# EAGLE design MultiSensorModul.v4 (EAGLE 9.6.2)
COMPANY: ADAFRUIT INDUSTRIES; DRAWN: KTOWN; REV: A
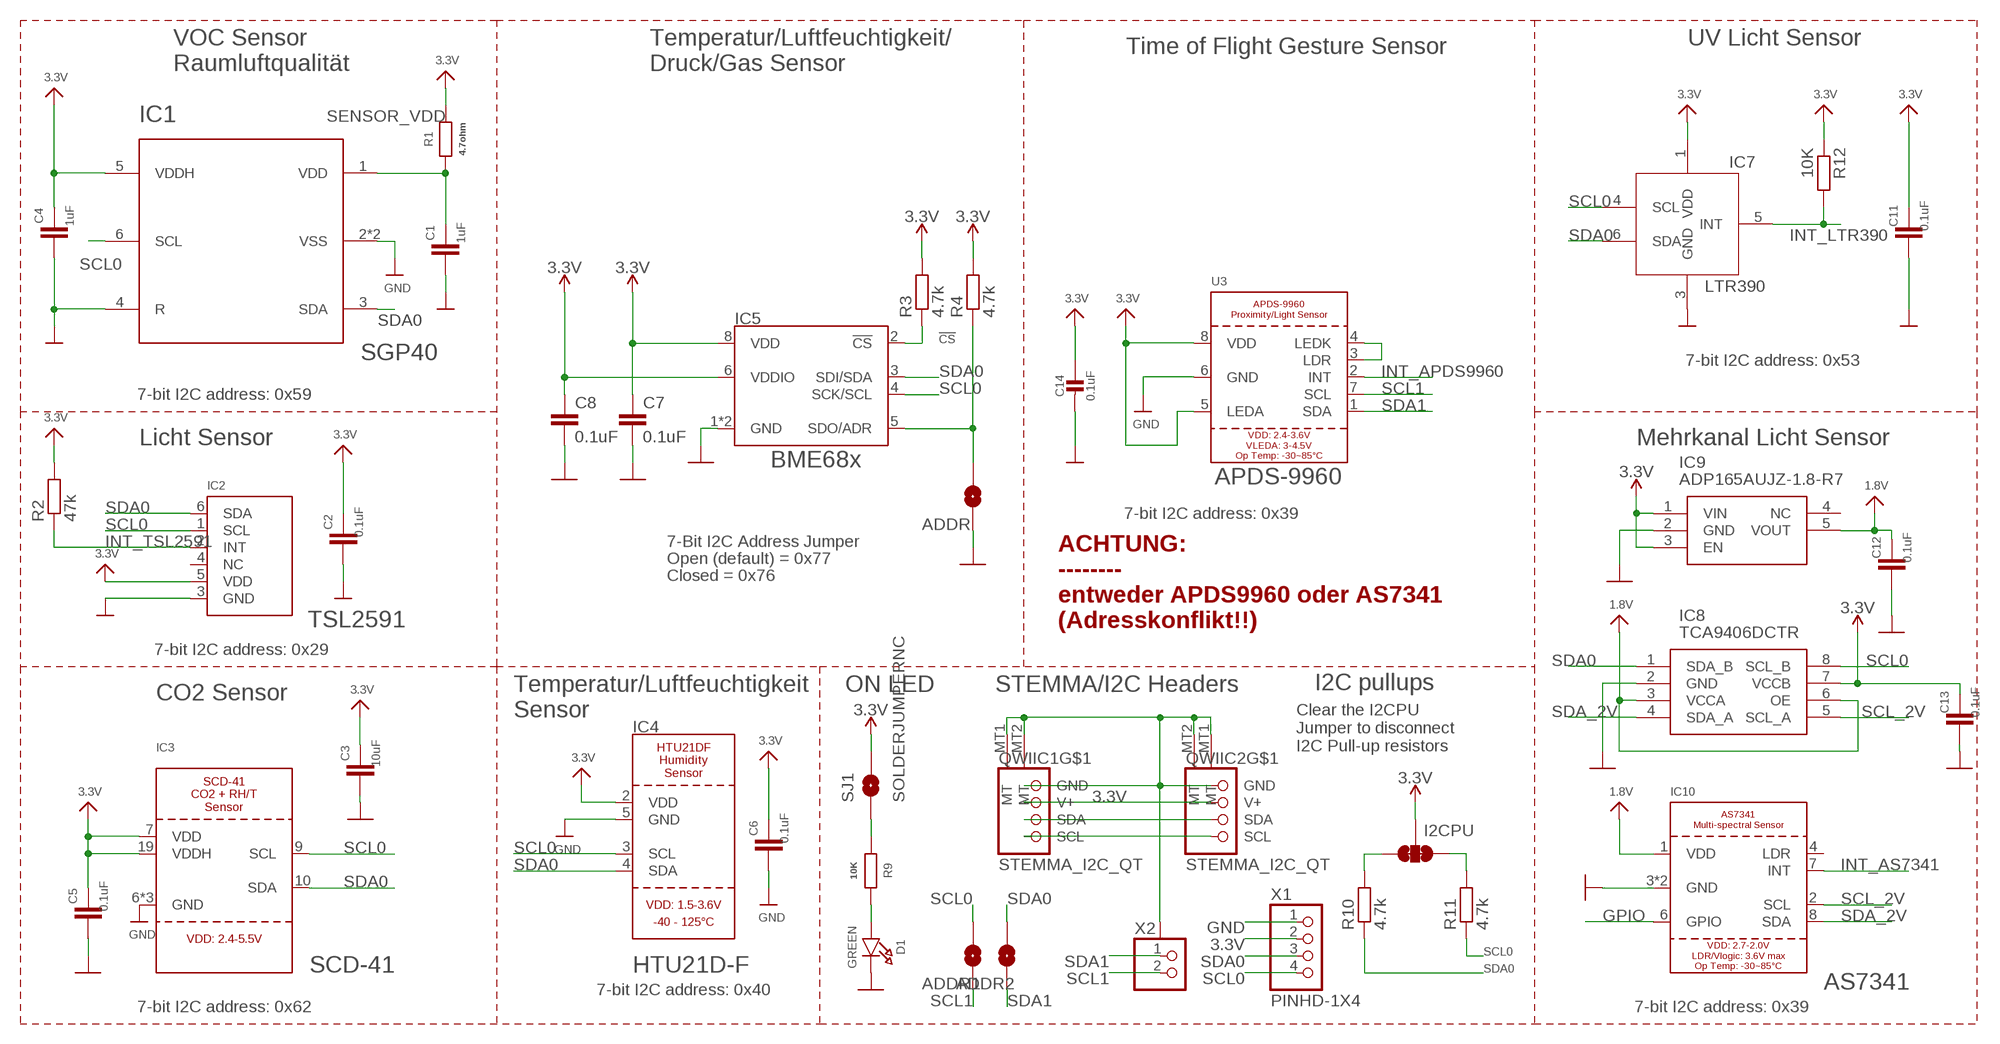
[diagram p0: schematic, sheet 1]

## Parts
ADDR  JUMPER-SMT_2_NO_SILK  [SMT-JUMPER_2_NO_SILK]
ADDR1  JUMPER-SMT_2_NO_SILK  [SMT-JUMPER_2_NO_SILK]
ADDR2  JUMPER-SMT_2_NO_SILK  [SMT-JUMPER_2_NO_SILK]
C1  1uF  C-EUC0805  [C0805]
C2  0.1uF  C-EUC0603  [C0603]
C3  10uF  C-EUC0805  [C0805]
C4  1uF  C-EUC0805  [C0805]
C5  0.1uF  C-EUC0603  [C0603]
C6  0.1uF  C-EUC0603  [C0603]
C7  0.1uF  C-EUC0603  [C0603]
C8  0.1uF  C-EUC0603  [C0603]
C11  0.1uF  C-EUC0603  [C0603]
C12  0.1uF  C-EUC0603  [C0603]
C13  0.1uF  C-EUC0603  [C0603]
C14  0.1uF  CAP_CERAMIC0603_NO  [0603-NO]
D1  GREEN  LED0603_NOOUTLINE  [CHIPLED_0603_NOOUTLINE]
I2CPU  I2C PU  JUMPER-SMT_3_2-NC_TRACE_SILK  [SMT-JUMPER_3_2-NC_TRACE_SILK]
IC1  SGP40  SGP30  [SGP30]
IC2  TSL2591  LIGHT_TSL2591  [DFN6_TAOS]
IC3  SCD-41  [SCD41]
IC4  HTU21D-F  HTU21DF  [HTU21DF]
IC5  BME680 Air Quality Sensor  BME680-LGA  [LGA3.0X3.0]
IC7  LTR390  [LTR390]
IC8  TCA9406DCTR  [SOP65P400X130-8N]
IC9  ADP165AUJZ-1.8-R7  ADP165AUJZ-3.3-R7  [SOT95P280X100-5N]
IC10  AS7341  [AS7341]
QWIIC1  STEMMA_I2C_QT  [JST_SH4]
QWIIC2  STEMMA_I2C_QT  [JST_SH4]
R1  4.7ohm  R-EU_R0603  [R0603]
R2  47k  R-EU_R0603  [R0603]
R3  4.7k  R-EU_R0603  [R0603]
R4  4.7k  R-EU_R0603  [R0603]
R9  10K  R-EU_R0603  [R0603]
R10  4.7k  R-EU_R0603  [R0603]
R11  4.7k  R-EU_R0603  [R0603]
R12  10K  R-EU_R0603  [R0603]
SJ1  SOLDERJUMPERNC  [SJ_2S]
U3  APDS-9960  [APDS-9960]
X1  PINHD-1X4  [1X04]
X2  PINHD-1X2  [1X02]

## Nets
1.8V [lowpower]: C12.1 IC8.3(VCCA) IC8.6(OE) IC9.5(VOUT) IC10.1(VDD)
3.3V [lowpower]: C2.1 C3.1 C4.1 C5.1 C6.1 C7.1 C8.1 C11.1 C13.1 C14.1 I2CPU.2 IC1.5(VDDH) IC2.5(VDD) IC3.7(VDD) IC3.19(VDDH) IC4.2(VDD) IC5.6(VDDIO) IC5.8(VDD) IC7.1(VDD) IC8.7(VCCB) IC9.1(VIN) IC9.3(EN) QWIIC1.2(V+) QWIIC2.2(V+) R1.2 R2.2 R3.2 R4.2 R12.1 SJ1.2 U3.5(LEDA) U3.8(VDD) X1.2
!CS: IC5.2(!CS) R3.1
GND [highpower]: ADDR.1 C1.2 C2.2 C3.2 C4.2 C5.2 C6.2 C7.2 C8.2 C11.2 C12.2 C13.2 C14.2 D1.C IC1.2(VSS) IC1.4(R) IC1.P$7(VSS) IC2.3(GND) IC3.6(GND) IC3.20(GND) IC3.P$1(GND) IC4.5(GND) IC5.1(GND) IC5.7(GND) IC7.3(GND) IC8.2(GND) IC9.2(GND) IC10.3(GND) IC10.5(GND) QWIIC1.1(GND) QWIIC1.MT1(MT) QWIIC1.MT2(MT) QWIIC2.1(GND) QWIIC2.MT1(MT) QWIIC2.MT2(MT) U3.6(GND) X1.1
GPIO: IC10.6(GPIO)
INT_APDS9960: U3.2(INT)
INT_AS7341: IC10.7(INT)
INT_LTR390: IC7.5(INT) R12.2
INT_TSL2591: IC2.2(INT) R2.1
N$1: D1.A R9.2
N$2: U3.3(LDR) U3.4(LEDK)
N$3 [lowpower]: R9.1 SJ1.1
N$4: I2CPU.3 R10.2
N$5: I2CPU.1 R11.2
SCL0: ADDR1.2 IC1.6(SCL) IC2.1(SCL) IC3.9(SCL) IC4.3(SCL) IC5.4(SCK/SCL) IC7.4(SCL) IC8.8(SCL_B) QWIIC1.4(SCL) QWIIC2.4(SCL) R11.1 X1.4
SCL1: ADDR1.1 U3.7(SCL) X2.2
SCL_2V: IC8.5(SCL_A) IC10.2(SCL)
SDA0: ADDR2.2 IC1.3(SDA) IC2.6(SDA) IC3.10(SDA) IC4.4(SDA) IC5.3(SDI/SDA) IC7.6(SDA) IC8.1(SDA_B) QWIIC1.3(SDA) QWIIC2.3(SDA) R10.1 X1.3
SDA1: ADDR2.1 U3.1(SDA) X2.1
SDA_2V: IC8.4(SDA_A) IC10.8(SDA)
SDO/ADR: ADDR.2 IC5.5(SDO/ADR) R4.1
SENSOR_VDD [lowpower]: C1.1 IC1.1(VDD) R1.1
Unconnected: IC2.4(NC) IC9.4(NC) IC10.4(LDR)

## Notes on the sheet
- Time of Flight Gesture Sensor
- VOC Sensor
  Raumluftqualität
- Temperatur/Luftfeuchtigkeit/
  Druck/Gas Sensor
- UV Licht Sensor
- 7-bit I2C address: 0x53
- 7-bit I2C address: 0x59
- Licht Sensor | Mehrkanal Licht Sensor
- BME68x
- 7-bit I2C address: 0x39
- 7-Bit I2C Address Jumper
- Open (default) = 0x77
- Closed = 0x76
- ACHTUNG:
  --------
  entweder APDS9960 oder AS7341
  (Adresskonflikt!!)
- 7-bit I2C address: 0x29
- ON LED | STEMMA/I2C Headers | I2C pullups
- CO2 Sensor
- Temperatur/Luftfeuchtigkeit 
  Sensor
- Clear the I2CPU 
  Jumper to disconnect
  I2C Pull-up resistors
- 7-bit I2C address: 0x40
- 7-bit I2C address: 0x62 | 7-bit I2C address: 0x39

## Library data of the parts
ADDR ADDR1 ADDR2 = SparkFun-Jumpers:JUMPER-SMT_2_NO: Normally open jumper This jumper has two pads in close proximity to each other. Apply solder to close the connection. Round pads are easier to solder for beginners, but are a lot larger. SparkFun Product that uses the round pads: SparkFun EL Sequencer <https://www.sparkfun.com/products/12781>
C1-C8 C11-C13 = rcl:C-EU: CAPACITOR, European symbol; SPICEPREFIX: C
C14 = microbuilder:CAP_CERAMIC: Ceramic Capacitors For new designs, use the packages preceded by an '_' character since they are more reliable: The following footprints should be used on most boards: _0402 - Standard footprint for regular board layouts _0603 - Standard footprint for regular board layouts _0805 - Standard footprint for regular board layouts _1206 - Standard footprint for regular board layouts For extremely tight-pitch boards where space is at a premium, the following 'micro-pitch' footprints can be used (smaller pads, no silkscreen outline, etc.): _0402MP - Micro-pitch footprint for very dense/compact boards _0603MP - Micro-pitch footprint for very dense/compact boards _0805MP - Micro-pitch footprint for very dense/compact boards _1206MP - Micro-pitch footprint for very dense/compact boards
D1 = microbuilder:LED: LED 0603 - 0603 Surface Mount Package 2mA: Green LED - Low Power (3.9mcd, 2ma, 1.7Vf) - Digikey: 475-2709-2-ND Orange LED - Low Power (9.8mcd, 2ma, 1.8Vf) - Digikey: 475-1194-2-ND Red LED - Low Power (5mcd, 2ma, 1.8Vf) - Digikey: 475-1195-2-ND Yellow LED - Low Power (7mcd, 2ma, 1.8Vf) - Digikey: 475-1196-2-ND 5mA: Blue LED - Low Power (17mcd, 5ma, 2.9Vf) - Digikey: LNJ937W8CRACT-ND 0805 - 0805 Surface Mount Package 2mA: Red LED (8.8mcd, 2mA, 1.8Vf, Clear) - Low Power [Digikey: 475-2510-1-ND] Green LED (5mcd, 2mA, 1.8Vf, Clear) - Low Power [Digikey: 475-2730-1-ND] Yellow LED (11.3mcd, 2mA, 1.8Vf, Clear) - Low Power [Digikey: 475-2555-1-ND] 20mA: Red LED (104mcd, 20mA, Diffused) - LS R976 [Digikey: 475-1278-6-ND] Red LED (12mcd, 20mA, 2.0Vf, Clear) - APT2012EC [Digikey: 754-1128-1-ND] Green LED (15mcd, 20mA, 2.2Vf, Clear) - APT2012GC [Digikey: 754-1131-1-ND] Orange LED (160mcd, 20mA, 2.1Vf, Clear) - APT2012SECK [Digikey: 754-1130-1-ND] 1206 - 1206 Surface Mount Package Green LED (26mcd, 20mA, Diffused) - LG N971 [Digikey: 475-1407-6-ND] Red LED (15mcd, 20mA, Diffused) - LH N974 [Digikey: 475-1416-6-ND] Cree - Cree High-Power Surface Mount LEDs XPEBWT-L1-0000-00D50 - White 111lm 350mA 2.9Vf 6200K 110° XTEAWT-00-0000-00000LEE3 - White 114lm 350mA 2.85Vf 5000K 115° Everlight - Everlight 45-21 Series Surface Mount LEDs 45-21/QK2C-B2832AC2CB2/2T - Warm White 2000mcd 20mA 3.25Vf 3050K 120° 45-21/LK2C-B38452C4CB2/2T - Nuetral White 2000mcd 20mA 3.25Vf 4150K 120° 45-21/LK2C-B50634C6CB2/2T - Cold White 2200mcd 20mA 3.25Vf 5650K 120° PLCC2 Reverse Mount LS T77K-J1L2-1-0-2-R18-Z - Red 11.25mcd 2mA 1.8Vf 630nm 120° LO T77K-L1M2-24-Z - Orange 19.6mcd 2mA 1.8Vf 606nm 120° LY T77K-K2M1-26-Z - Yellow 15.7mcd 2mA 1.8Vf 587nm 120°
I2CPU = SparkFun-Jumpers:JUMPER-SMT_3_2-NC_TRACE: Normally closed trace jumper (2 of 2 connections) This jumper has a trace between all three pads so they are normally closed (NC). Use a razor knife to open the connection(s). For best results follow the IPC guidelines for cutting traces: Cutout at least 0.063 mm (0.005 in). Remove all loose material to clean up the cut area. Seal the cut with an approved epoxy. Reapply solder to reclose the connection(s).
IC1 = microbuilder:SGP30: Sensirion SGP30 multi-pixel gas sensor
IC2 = microbuilder:LIGHT_TSL2591: TSL2591 Light-To-Digital Sensor
IC3 = adafruit_sensor:SCD-41
IC4 = adafruit_sensor:HTU21DF: HTU21DF - Relative Humidity and Temperature Sensor
IC5 = SparkFun-Sensors:BME680: Bosch BME680 – Combined Humidity and Pressure Sensor The BME680 is as combined digital humidity, pressure and temperature sensor based on proven sensing principles. The sensor module is housed in an extremely compact metal-lid LGA package with a footprint of only 3.0×3.0mm with a height of 0.93mm. Its small dimensions and its low power consumption allow the implementation in battery driven devices such as handsets, GPS modules or watches.; PROD_ID: IC-14656; VALUE: BME680
IC7 = adafruit_sensor:LTR390
IC8 = SamacSys_Parts:TCA9406DCTR: 2-Bit Bidirectional 1-MHz I2C Bus and SMBus Voltage-Level Shifter Source: Datasheet <http://www.ti.com/lit/ds/symlink/tca9406.pdf>; DESCRIPTION: 2-Bit Bidirectional 1-MHz I2C Bus and SMBus Voltage-Level Shifter; HEIGHT: 1.3mm; MANUFACTURER_NAME: Texas Instruments; MANUFACTURER_PART_NUMBER: TCA9406DCTR; MOUSER_PART_NUMBER: 595-TCA9406DCTR; MOUSER_PRICE-STOCK: https://www.mouser.co.uk/ProductDetail/Texas-Instruments/TCA9406DCTR?qs=Ze4%2FuFuz19L6Yntu0RTUyw%3D%3D
IC9 = SamacSys_Parts:ADP165AUJZ-3.3-R7: LDO Voltage Regulators Low Iq LDO with Passthrough option Source: Datasheet <https://www.analog.com/media/en/technical-documentation/data-sheets/ADP165_166.pdf>; DESCRIPTION: LDO Voltage Regulators Low Iq LDO with Passthrough option; HEIGHT: 1mm; MANUFACTURER_NAME: Analog Devices; MANUFACTURER_PART_NUMBER: ADP165AUJZ-3.3-R7; MOUSER_PART_NUMBER: 584-ADP165AUJZ3.3R7; MOUSER_PRICE-STOCK: https://www.mouser.co.uk/ProductDetail/Analog-Devices/ADP165AUJZ-33-R7?qs=iCT64eccu7gGKvcy8Wq8Jg%3D%3D
IC10 = adafruit_sensor:AS7341
QWIIC1 QWIIC2 = microbuilder:STEMMA_I2C
R1-R4 R9-R12 = rcl:R-EU_: RESISTOR, European symbol; SPICEPREFIX: R
SJ1 = HSW_ATM-Passives:SOLDERJUMPER: Solder Jumper Standard SMD solder jumper. Used to automate production. Two varients : Normally Open and Normally Closed are the same, but have different paste layers. NC will have a large amount of paste and should jumper during reflow.
U3 = microbuilder:APDS-9960: APDS-9960 - Digital Proximity Sensor with Ambient Light/RGB/Gesture Detection
X1 = HSW_ATM-Connector:PINHD-1X4
X2 = HSW_ATM-Connector:PINHD-1X2: PIN HEADER

## Net classes
1 highpower: width 0.152 mm, drill 0.3 mm
2 lowpower: width 0.152 mm, drill 0.3 mm

## Board
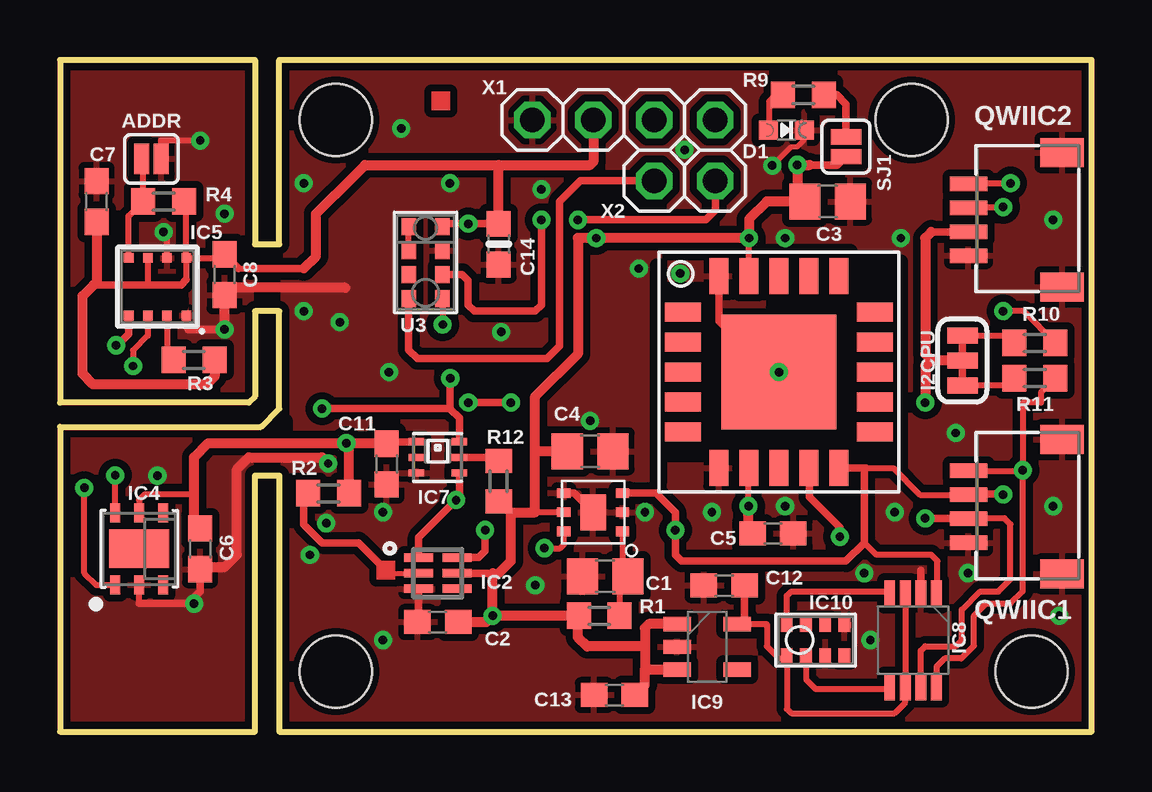
[diagram p1: board, top side]
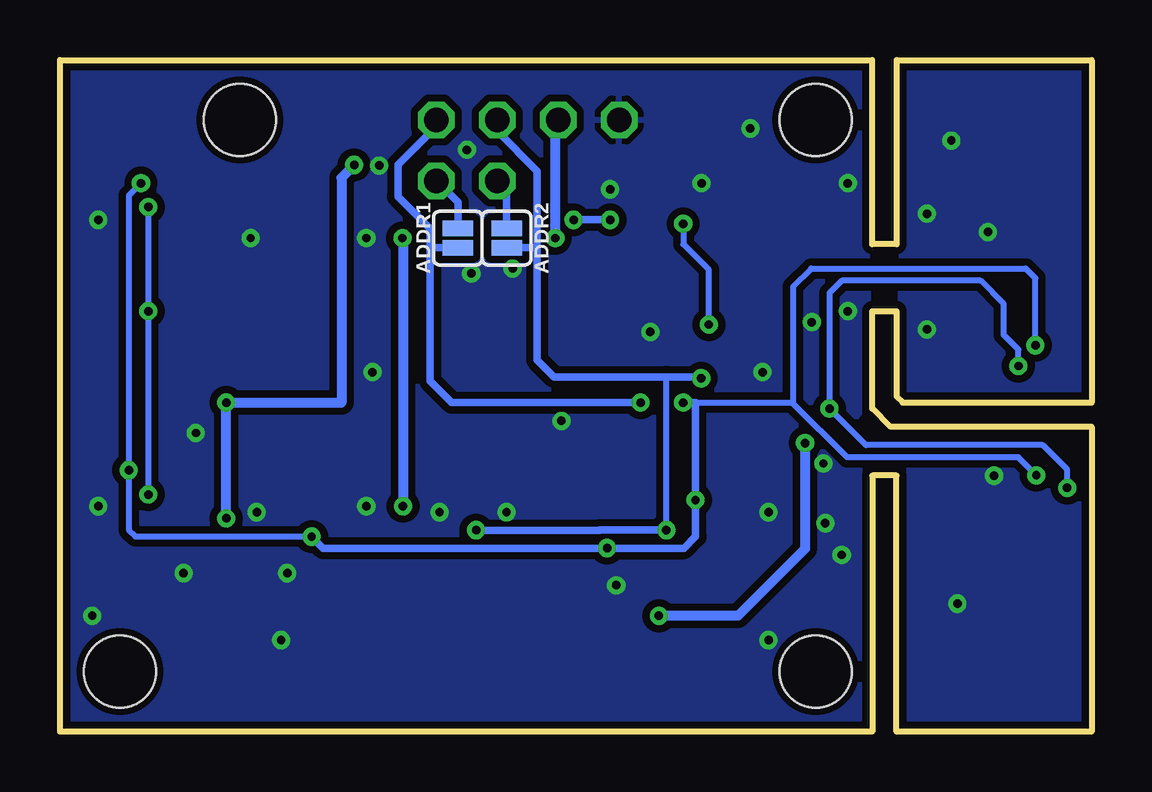
[diagram p2: board, bottom side, seen from below]

Size 43 x 28 mm. Coordinates in mm from the lower left corner, seen from the top.
Outline: 43,0 43,28 9.14,28 9.14,20.32 8.13,20.32 8.13,28 0,28 0,13.72 7.87,13.72 8.13,13.97 8.13,17.53 9.14,17.53 9.14,13.46 8.38,12.7 0,12.7 0,0 8.13,0 8.13,10.67 9.14,10.67 9.14,0 43,0
Copper layers (1*16): Top 0.035mm / dielectric 1.5mm / Bottom 0.035mm
Design rules "default *": minimum track width 0.15mm, minimum drill 0.32mm, track to track 6mil, track to pad 6mil, pad to pad 6mil, via to via 6mil, smd to smd 6mil, copper to edge 0.2mm, drill to drill 6mil, minimum pad ring 10mil, minimum via ring 8mil, stop-mask expansion 4mil, vias tented up to drill 0.4mm, thermal gap 10mil
Holes 3 mm at 40.5,2.5 35.5,25.5 11.5,25.5 11.5,2.5
tRestrict: area 27.1,17 to 27.3,17.5; area 32.4,14.7 to 32.6,15.2; area 29.7,12.3 to 30.2,12.6; area 29.7,17.4 to 30.2,17.7; area 27.2,11.8 to 27.7,12.1; area 34.9,11.2 to 35.1,19.6; area 24.9,10.4 to 25,19.4; area 25.4,19.9 to 27.2,20.1; area 27.2,19.9 to 27.8,20.1; area 27.3,14.7 to 27.6,15.2; area 29.2,19.8 to 32.9,20; area 8.4,18 to 8.9,18.3; 7 more areas
bRestrict: area 8.4,18 to 8.9,18.3; area 8.4,19.6 to 8.9,19.8; area 9.1,12.4 to 9.4,13

### Footprints (pad centres in the part's own frame; a part is rotated, then mirrored left to right if it is on the bottom)
SMT-JUMPER_2_NO_SILK = smd 0.635 x 1.27: 1 -0.406,0; 2 0.406,0
C0805 = smd 1.3 x 1.5: 1 -0.95,0; 2 0.95,0
C0603 = smd 1.1 x 1: 1 -0.85,0; 2 0.85,0
0603-NO = smd 1.075 x 1: 1 -0.85,0; 2 0.85,0
CHIPLED_0603_NOOUTLINE = smd 0.8 x 0.8: A 0,-0.75; C 0,0.75
SMT-JUMPER_3_2-NC_TRACE_SILK = smd 0.66 x 1.27: 1 -1.041,0; 2 0,0; 3 1.041,0
SGP30 = smd 0.55 x 0.4: 1 -1.225,0.8; 2 -1.225,0; 3 -1.225,-0.8; 4 1.225,-0.8; 5 1.225,0; 6 1.225,0.8 | smd 1.05 x 1.5: P$7 0,0
DFN6_TAOS = smd 1.2 x 0.35: 1 -0.8,0.65; 2 -0.8,0; 3 -0.8,-0.65; 4 0.8,-0.65; 5 0.8,0; 6 0.8,0.65
SCD41 = smd 1.5 x 0.8: 1 -4,2.5; 2 -4,1.25; 3 -4,0; 4 -4,-1.25; 5 -4,-2.5; 11 4,-2.5; 12 4,-1.25; 13 4,0; 14 4,1.25; 15 4,2.5 | smd 0.8 x 1.5: 6 -2.5,-4; 7 -1.25,-4; 8 0,-4; 9 1.25,-4; 10 2.5,-4; 16 2.5,4; 17 1.25,4; 18 0,4; 19 -1.25,4; 20 -2.5,4 | smd 4.8 x 4.8: P$1 0,0
HTU21DF = smd 0.8 x 0.4: 1 -1.5,1; 2 -1.5,0; 3 -1.5,-1; 4 1.5,-1; 5 1.5,0; 6 1.5,1 | smd 1.6 x 2.5: PAD 0,0
LGA3.0X3.0 = smd 0.4 x 0.4: 1 1.2,1.2; 2 1.2,0.4; 3 1.2,-0.4; 4 1.2,-1.2; 5 -1.2,-1.2; 6 -1.2,-0.4; 7 -1.2,0.4; 8 -1.2,1.2
LTR390 = smd 0.65 x 0.3: 1 -0.9,0.65; 2 -0.9,0; 3 -0.9,-0.65; 4 0.9,-0.65; 5 0.9,0; 6 0.9,0.65
SOP65P400X130-8N = smd 1.1 x 0.45: 1 -1.95,0.975; 2 -1.95,0.325; 3 -1.95,-0.325; 4 -1.95,-0.975; 5 1.95,-0.975; 6 1.95,-0.325; 7 1.95,0.325; 8 1.95,0.975
SOT95P280X100-5N = smd 1.15 x 0.6: 1 -1.25,0.95; 2 -1.25,0; 3 -1.25,-0.95; 4 1.25,-0.95; 5 1.25,0.95
AS7341 = smd 0.575 x 0.488: 1 -0.635,1.2; 2 -0.635,0.4; 3 -0.635,-0.4; 4 -0.635,-1.2; 5 0.635,-1.2; 6 0.635,-0.4; 7 0.635,0.4; 8 0.635,1.2
JST_SH4 = smd 0.6 x 1.55: 1 -1.5,2.514; 2 -0.5,2.514; 3 0.5,2.514; 4 1.5,2.514 | smd 1.2 x 1.8: MT1 -2.8,-1.386; MT2 2.8,-1.386
R0603 = smd 1 x 1.1: 1 -0.85,0; 2 0.85,0
SJ_2S = smd 0.635 x 1.27: 1 -0.412,0; 2 0.412,0
APDS-9960 = smd 0.6 x 0.72: 1 0.7,1.505; 2 0.7,0.505; 3 0.7,-0.495; 4 0.7,-1.495; 5 -0.7,-1.495; 6 -0.7,-0.495; 7 -0.7,0.505; 8 -0.7,1.505
1X04 = drill 1.016 octagon: 1 -3.81,0; 2 -1.27,0; 3 1.27,0; 4 3.81,0
1X02 = drill 1.016 octagon: 1 -1.27,0; 2 1.27,0

### Placement (x,y rotation side)
ADDR  3.81,23.88 180 top
ADDR1  26.42,20.57 270 bottom
ADDR2  24.38,20.57 270 bottom
C1  22.73,6.48 180 top
C2  15.75,4.57 180 top
C3  32,22.1 0 top
C4  22.1,11.68 0 top
C5  29.72,8.26 0 top
C6  5.84,7.62 270 top
C7  1.52,22.1 90 top
C8  6.86,19.05 270 top
C11  13.61,11.15 270 top
C12  27.69,6.1 180 top
C13  23.11,1.52 180 top
C14  18.29,20.32 270 top
D1  30.28,25.07 270 top
I2CPU  37.62,15.47 90 top
IC1  22.23,9.14 180 top
IC2  15.75,6.6 0 top
IC3  29.97,14.99 0 top
IC4  3.3,7.62 270 top
IC5  4.06,18.54 270 top
IC7  15.75,11.43 0 top
IC8  35.56,3.81 270 top
IC9  26.97,3.53 0 top
IC10  31.5,3.81 90 top
QWIIC1  40.39,9.37 90 top
QWIIC2  40.39,21.34 90 top
R1  22.48,4.83 180 top
R2  11.2,9.93 0 top
R3  5.59,15.49 0 top
R4  4.32,22.1 0 top
R9  30.99,26.54 180 top
R10  40.64,16.21 180 top
R11  40.64,14.73 180 top
R12  18.29,10.44 90 top
SJ1  32.77,24.38 270 top
U3  15.24,19.56 180 top
X1  23.5,25.5 0 top
X2  26.04,22.96 0 top

### Tracks (layer width: path | path; a pad name or v marks a point on that pad's centre or on a via)
1.8V
  Top 0.254: IC10.1 30.3,3.05 | 30.3,3.05 30.3,0.95 30.48,0.76 34.8,0.76 35.23,1.2 IC8.6 IC8.3 | IC9.5 28.45,4.48 29.46,4.48 29.46,3.56 29.97,3.05 30.3,3.05
  Top 0.305: C12.1 28.54,4.57 28.45,4.48
3.3V  (via drill 0.35)
  Top 0.254: IC1.5 19.81,9.14 | IC4.2 3.3,9.65 3.56,9.91 5.59,9.91 | IC5.8 6.7,19.74 | IC5.8 5.26,22 R4.2 | 7.45,19.3 7.87,19.3 | 36.32,15.49 36.3,15.47 | 18.03,6.6 18.29,6.6 | IC5.8 5.26,18.83 | IC5.6 3.66,18.64 3.68,18.62 | 21.59,4.79 R1.2 | IC8.7 35.88,3.37 36.07,3.56 37.34,3.56 37.59,3.81 37.59,5.08 38.35,5.84 39.12,5.84 39.62,6.35 39.62,8.64 39.37,8.89 37.85,8.89 | U3.8 v15.94,16.98 v15.95,16.97 | IC3.19 v28.72,20.57 | C5.1 28.87,8.47 28.7,8.64 | v28.7,9.4 28.7,10.97 IC3.7
  Top 0.305: C6.1 5.59,8.72 | 7.45,19.3 C8.1 6.7,19.74 | 36.32,20.83 37.86,20.83 QWIIC2.2 | IC7.1 13.69,12.08 C11.1 | R12.1 18.35,9.59 18.8,9.14 | IC2.5 18.03,6.6 | QWIIC1.2 37.85,8.89 v36.07,8.89 | 7.87,19.3 10.16,19.3 | 1.41,18.62 3.68,18.62 5.05,18.62 5.26,18.83 | 12.05,11.91 v11.94,12.03 | C13.1 24.38,1.94 | 11.44,22.35 11.43,22.35 | U3.5 16.06,21.17 v17.02,21.17 C14.1 | 31.24,23.62 32.42,23.62 SJ1.2
  Top 0.406: 5.59,8.72 5.59,9.91 5.59,11.43 6.18,12.03 v11.94,12.03 11.96,12 C11.1 | R1.2 v18.03,4.83 | C7.1 1.52,18.75 1.4,18.62 | v36.07,13.72 36.07,15.24 36.3,15.47 I2CPU.2 | 36.32,20.83 36.07,20.57 36.07,15.75 36.32,15.49 | C2.1 17.78,4.57 v18.03,4.83 | v18.03,4.83 18.03,6.6 | 10.16,19.3 10.67,19.81 10.67,21.59 11.43,22.35 | R3.2 6.44,14.79 6.12,14.48 1.37,14.48 0.94,14.91 0.94,18.16 1.4,18.62 | 19.81,11.68 19.81,9.14 18.8,9.14 18.8,7.11 18.29,6.6 | 19.81,11.68 19.81,13.97 21.59,15.75 21.59,20.57 v22.35,20.57 v28.72,20.57 28.72,21.36 29.46,22.1 C3.1 30.73,22.42 v30.73,23.62 31.24,23.62 | 18.29,23.62 12.71,23.62 11.44,22.35 | 1.41,18.62 1.4,18.62 | R2.2 12.05,11.91 | IC9.3 24.38,2.58 | 24.38,3.55 21.98,3.55 21.59,3.94 21.59,4.79 | IC9.1 24.55,4.48 24.38,4.32 24.38,3.55 | 24.38,3.55 24.38,2.58 | 24.38,1.94 24.38,2.58 | 18.29,23.62 22.1,23.62 22.23,23.75 X1.2 | C14.1 18.29,23.62 | 28.7,8.64 v28.7,9.4 | C4.1 19.81,11.68
  Bottom 0.254: v15.95,16.97 15.95,19.25 17.02,20.32 v17.02,21.17 | v28.72,20.57 28.7,20.55
  Bottom 0.305: 22.35,25.38 X1.2
  Bottom 0.406: v30.73,23.62 31.27,23.09 31.27,13.72 v36.07,13.72 v36.07,8.89 | v11.94,12.03 11.94,7.62 14.73,4.83 v18.03,4.83 | 28.7,20.55 v28.7,9.4 | v22.35,20.57 22.35,25.38
!CS
  Top 0.254: IC5.2 4.46,15.77 R3.1
GND  (via drill 0.35)
  Top 0.203: v29.69,23.6 30.48,24.38 30.73,24.38 31.03,24.68 D1.C
  Top 0.254: 3.3,5.33 IC4.5 | 5.33,16.76 5.26,16.83 IC5.1 | IC5.7 4.46,20.68 | v5.84,24.64 4.22,24.64 ADDR.1
  Top 0.305: IC3.P$1 29.59,14.99 27.47,17.11 IC3.20 | IC1.4 21.43,9.94 IC1.P$7 | 3.3,5.33 5.33,5.33 5.84,5.84 C6.2 5.93,6.86 | v6.86,16.76 5.33,16.76 | 4.46,20.68 v4.32,20.83 | C8.2 7.16,18.5 | IC2.3 14.95,4.62 C2.2 | IC8.2 35.88,6.71
  Top 0.406: v6.86,16.76 C8.2 | 5.93,6.86 6.86,6.86 7.37,7.37 7.37,10.92 7.87,11.43 10.92,11.43 v11.18,11.18 | 11.89,18.5 7.16,18.5
  other vias: 29.97,14.99 25.86,19.1 5.59,5.33 41.4,9.4 4.06,10.67 10.16,22.86 30.23,20.57 24.38,9.14 27.18,9.14 6.86,21.59 13.72,14.99 41.4,21.34 24.13,19.3 35.05,20.57 16.26,22.86 20.07,22.61 14.22,25.15 19.81,6.1 22.1,12.95 13.46,9.14 10.41,7.37 10.16,17.53 13.46,3.81 11.1,8.69 34.8,9.14 30.23,9.4 33.53,6.6 41.66,4.83 33.78,3.81 37.85,6.6 18.39,16.66 11.66,17.07 37.34,12.45 26.04,24.26
  pour Top (isolate 0.305): -1.15,29.28 44.45,29.28 44.45,-2.49 -1.15,-2.49
  pour Bottom (isolate 0.305): -0.51,28.96 43.43,28.96 43.43,-2.29 -0.51,-2.29
INT_LTR390
  Top 0.305: R12.2 18.15,11.43 IC7.5
INT_TSL2591
  Top 0.203: 13.72,6.6 IC2.2
  Top 0.305: R2.1 10.16,9.74 10.16,8.64 10.92,7.87 12.45,7.87 13.72,6.6
N$1
  Top 0.254: R9.2 29.83,26.54 29.55,26.26 29.55,25.1 D1.A
N$2
  Top 0.254: U3.3 U3.4
N$3
  Top 0.305: R9.1 32.38,26.54 32.77,26.16 SJ1.1
N$4
  Top 0.254: I2CPU.3 39.48,16.51 R10.2
N$5
  Top 0.254: R11.2 39.48,14.43 I2CPU.1
SCL0  (via drill 0.35)
  Top 0.254: QWIIC1.4 40.11,10.87 | 40.11,10.87 v40.13,10.9 40.13,13.72 40.89,13.72 40.89,14.14 R11.1 | IC1.6 21,7.79 20.85,7.64 v20.19,7.64 | 37.39,22.86 v39.62,22.86 | IC4.3 v2.3,10.68 | IC8.8 36.53,2.7 36.88,3.05 37.57,3.05 38.1,3.58 38.1,4.83 38.61,5.33 39.62,5.33 40.13,5.84 40.13,10.85 40.11,10.87
  Top 0.305: IC3.9 31.24,10.97 31.24,9.78 32.51,8.51 v32.51,8.13 | IC5.4 2.86,16.58 2.39,16.1 v2.34,16.1 | IC7.4 16.65,9.79 v16.51,9.65 14.95,8.09 IC2.1 | QWIIC2.4 37.41,22.84 37.39,22.86 | v18.8,13.72 v17.02,13.72
  Bottom 0.254: v39.62,22.86 40.13,22.35 v40.13,10.9 40.13,8.41 39.85,8.13 v32.51,8.13 | v2.3,10.68 3.05,11.43 10.19,11.43 12.46,13.7 12.45,13.72 | v2.34,16.1 2.34,18.9 2.74,19.3 11.68,19.3 12.45,18.54 12.45,13.72 | v17.02,13.72 12.45,13.72
  Bottom 0.305: v32.51,8.13 32.03,7.64 v20.19,7.64 16.99,7.64 16.51,8.13 v16.51,9.65 16.51,13.72 v17.02,13.72 | 27.56,20.17 27.56,20.96 28.91,22.31 28.91,23.64 27.31,25.25 X1.4 | 27.56,20.17 27.56,14.61 26.67,13.72 v18.8,13.72 | ADDR1.2 27.56,20.17
SCL1  (via drill 0.35)
  Top 0.305: U3.7 16.76,19.05 17.02,18.8 17.02,17.78 17.27,17.53 19.81,17.53 20.07,17.78 v20.07,21.34 | v21.59,21.34 26.92,21.34 27.33,21.74 27.33,22.94 X2.2
  Bottom 0.305: v21.59,21.34 v20.07,21.34 | ADDR1.1 26.42,22.07 X2.2
SCL_2V
  Top 0.254: IC10.2 31.1,2.18 31.5,1.78 34.5,1.78 IC8.5
SDA0  (via drill 0.35)
  Top 0.203: v16.27,14.73 16.27,14.49
  Top 0.254: IC4.4 2.3,6.1 1.52,6.1 1.02,6.6 v1.02,10.16 | IC5.3 3.66,16.51 3.05,15.89 v3.05,15.24 | QWIIC2.3 39.29,21.84 v39.32,21.87 | 33.53,10.99 33.59,10.99 34.73,10.99 35.85,9.87 QWIIC1.3 | R10.1 40.17,17.53 v39.32,17.53 | IC8.1 36.58,5.8 36.58,7.11 36.32,7.37 34.04,7.37 33.53,7.87
  Top 0.305: v39.32,9.88 39.29,9.91 37.91,9.91 QWIIC1.3 | IC3.10 33.59,10.99 | 16.27,14.49 16.27,13.46 | 16.27,13.46 16.27,13.45 16.65,13.07 IC7.6 | IC1.3 24.85,9.94 25.65,9.14 v25.65,8.39 25.65,7.37 25.91,7.11 32.77,7.11 33.53,7.87 33.53,10.99 | v17.73,8.39 17.73,7.54 17.44,7.25 IC2.6 | 16.27,13.46 v10.92,13.46
  Bottom 0.254: v39.32,21.87 v39.32,17.53 v39.32,9.88 | v1.02,10.16 1.02,10.92 2.03,11.94 9.4,11.94 v10.92,13.46 10.92,18.29 10.41,18.8 4.62,18.8 3.66,17.83 3.66,16.54 3.05,15.93 v3.05,15.24 | v17.73,8.39 17.73,14.79 | v16.27,14.73 16.32,14.79
  Bottom 0.305: v25.65,8.39 20.52,8.39 20.51,8.4 17.8,8.4 17.78,8.38 v17.74,8.38 v17.73,8.39 | 16.32,14.79 17.73,14.79 22.41,14.79 23.11,15.49 23.11,20.07 | X1.3 24.77,25.02 23.11,23.37 23.11,20.07 | ADDR2.2 23.22,20.17 23.11,20.07
SDA1
  Top 0.305: U3.1 14.54,15.91 14.91,15.54 20.3,15.54 20.83,16.08 20.83,22.1 21.69,22.96 X2.1
  Bottom 0.305: ADDR2.1 24.38,22.57 X2.1
SDA_2V
  Top 0.254: IC10.8 30.3,5.66 30.48,5.84 34.5,5.84 IC8.4
SDO/ADR
  Top 0.254: IC5.5 2.86,21.49 R4.1 3.47,23.81 ADDR.2
SENSOR_VDD
  Top 0.254: IC1.1 23.45,6.71 C1.1 23.33,6.12 R1.1
(copper drawn outside any net)
  shapes: Top area x2

### Text on the board
tDocu: APDS9960 | BME68x | SCD4x | LTR390 | SGP40 | TSL2591 | HTU21D | AS7341 | Multisensor / 230627